# Altium schematic sheet Sheet1_ASC.SchDoc
size A4; SheetNumber: 1; SheetTotal: 1
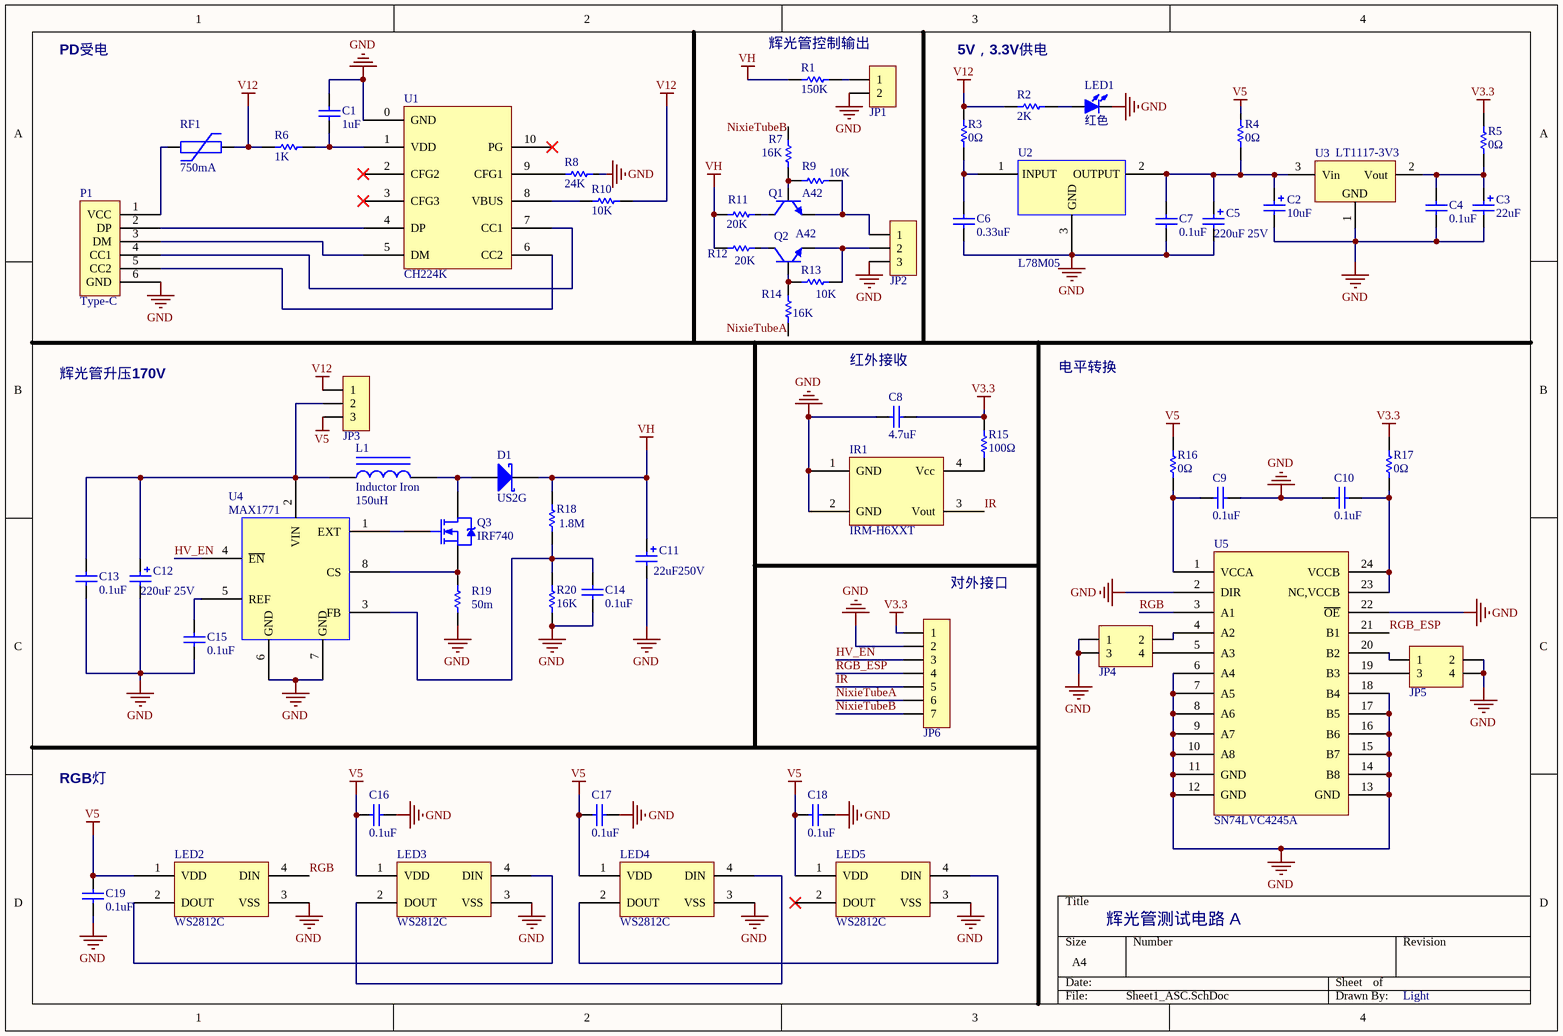
[diagram p0: Sheet1_ASC.SchDoc]

## Parts
C1  value 1uF  [C 0805_L]  (hidden comment: Cap)
C2  value 10uF  [CM B(4*5.4)]  (hidden comment: Cap Pol1)
C3  value 22uF  [CD C(6032)]  (hidden comment: Cap Pol1)
C4  value 0.1uF  [C 0805_L]  (hidden comment: Cap)
C5  value 220uF 25V  [CM E(8*10.2)]  (hidden comment: Cap Pol1)
C6  value 0.33uF  [C 0805_L]  (hidden comment: Cap)
C7  value 0.1uF  [C 0805_L]  (hidden comment: Cap)
C8  value 4.7uF  [C 0805_L]  (hidden comment: Cap)
C9  value 0.1uF  [C 0805_L]  (hidden comment: Cap)
C10  value 0.1uF  [C 0805_L]  (hidden comment: Cap)
C11  value 22uF250V  [CAP 5.0*10*16-H - GD]  (hidden comment: Cap Pol1)
C12  value 220uF 25V  [CM E(8*10.2)]  (hidden comment: Cap Pol1)
C13  value 0.1uF  [C 0805_L]  (hidden comment: Cap)
C14  value 0.1uF  [C 0805_L]  (hidden comment: Cap)
C15  value 0.1uF  [C 0805_L]  (hidden comment: Cap)
C16  value 0.1uF  [C 0805_L]  (hidden comment: Cap)
C17  value 0.1uF  [C 0805_L]  (hidden comment: Cap)
C18  value 0.1uF  [C 0805_L]  (hidden comment: Cap)
C19  value 0.1uF  [C 0805_L]  (hidden comment: Cap)
D1  US2G  [SMA]
IR1  IRM-H6XXT  [SMD4_IR]
JP1  HDR-1X2  [HDR2.54-LI-2P]  (value not drawn)
JP2  HDR-1X3  [HDR2.54-LI-3P]  (value not drawn)
JP3  HDR-1X3  [HDR2.54-LI-3P]  (value not drawn)
JP4  Header2X2  [HDR2.54-LI-2x2P]  (value not drawn)
JP5  Header2X2  [HDR2.54-LI-2x2P]  (value not drawn)
JP6  HDR-1X7  [HDR2.54-LI-7P]  (value not drawn)
L1  Inductor Iron  value 150uH  [CDRH127]
LED1  红色  [LED 1206R]
LED2  WS2812C  [WS2812]
LED3  WS2812C  [WS2812]
LED4  WS2812C  [WS2812]
LED5  WS2812C  [WS2812]
P1  Type-C  [USB-C-SMD_10P-P1.00-L6.8-W8.9]
Q1  A42  [SOT23-3L]
Q2  A42  [SOT23-3L]
Q3  IRF740  [TO-263-2L]
R1  value 150K  [R 0805_L]  (hidden comment: Res Semi)
R2  value 2K  [R 0805_L]  (hidden comment: Resistor)
R3  value 0Ω  [R 0805_L]  (hidden comment: Resistor)
R4  value 0Ω  [R 0805_L]  (hidden comment: Resistor)
R5  value 0Ω  [R 0805_L]  (hidden comment: Resistor)
R6  value 1K  [R 1206_L]  (hidden comment: Resistor)
R7  value 16K  [R 0805_L]  (hidden comment: Resistor)
R8  value 24K  [R 0805_L]  (hidden comment: Resistor)
R9  value 10K  [R 0805_L]  (hidden comment: Resistor)
R10  value 10K  [R 0805_L]  (hidden comment: Resistor)
R11  value 20K  [R 0805_L]  (hidden comment: Res Semi)
R12  value 20K  [R 0805_L]  (hidden comment: Res Semi)
R13  value 10K  [R 0805_L]  (hidden comment: Resistor)
R14  value 16K  [R 0805_L]  (hidden comment: Resistor)
R15  value 100Ω  [R 0805_L]  (hidden comment: Resistor)
R16  value 0Ω  [R 0805_L]  (hidden comment: Resistor)
R17  value 0Ω  [R 0805_L]  (hidden comment: Resistor)
R18  value 1.8M  [R 0805_L]  (hidden comment: Res Semi)
R19  value 50m  [R 1206_L]  (hidden comment: Res Semi)
R20  value 16K  [R 0805_L]  (hidden comment: Resistor)
RF1  750mA  [FU 1812]
U1  CH224K  [ESSOP10]
U2  L78M05  [TO-252-2L]
U3  LT1117-3V3  [SOT223_L]
U4  MAX1771  [SOIC8]
U5  SN74LVC4245A  [TSSOP24_L]

## Nets
GND: C1.2 C2.2 C3.2 C4.1 C5.2 C6.1 C7.1 C8.2 C9.1 C10.2 C11.2 C12.2 C13.1 C14.1 C15.2 C16.1 C17.1 C18.1 C19.1 IR1.1(GND) IR1.2(GND) JP1.2 JP2.3 JP4.1 JP4.3 JP5.2 JP5.4 JP6.2 LED1.2(K) LED2.3(VSS) LED3.3(VSS) LED4.3(VSS) LED5.3(VSS) P1.6(GND) R8.1 R19.2 R20.1 U1.0(GND) U2.3(GND) U3.1(GND) U4.6(GND) U4.7(GND) U5.2(DIR) U5.6(A4) U5.7(A5) U5.8(A6) U5.9(A7) U5.10(A8) U5.11(GND) U5.12(GND) U5.13(GND) U5.14(B8) U5.15(B7) U5.16(B6) U5.17(B5) U5.18(B4) U5.22(~{OE})
V3.3: C8.1 JP6.1 R5.2 R15.2 R17.2
V5: C16.2 C17.2 C18.2 C19.2 JP3.3 LED2.1(VDD) LED3.1(VDD) LED4.1(VDD) LED5.1(VDD) R4.2 R16.2
V12: JP3.1 R2.2 R3.2 R6.2 R10.1 RF1.2
VH: C11.1 D1.2(K) R1.1 R11.1 R12.1 R18.1
HV_EN: JP6.3 U4.4(~{EN})
IR: IR1.3(Vout) JP6.5
NixieTubeA: JP6.6 R14.2
NixieTubeB: JP6.7 R7.2
RGB: LED2.4(DIN) U5.3(A1)
RGB_ESP: JP6.4 U5.21(B1)
NetC1_1: C1.1 R6.1 U1.1(VDD)
NetC2_1: C2.1 C5.1 C7.2 R4.1 U2.2(OUTPUT) U3.3(Vin)
NetC3_1: C3.1 C4.2 R5.1 U3.2(Vout)
NetC6_2: C6.2 R3.1 U2.1(INPUT)
NetC9_2: C9.2 R16.1 U5.1(VCCA)
NetC10_1: C10.1 R17.1 U5.23(NC,VCCB) U5.24(VCCB)
NetC12_1: C12.1 C13.2 JP3.2 L1.1 U4.2(VIN)
NetC14_2: C14.2 R18.2 R20.2 U4.3(FB)
NetC15_1: C15.1 U4.5(REF)
NetD1_1: D1.1(A) L1.2 Q3.2(D)
NetIR1_4: IR1.4(Vcc) R15.1
NetJP1_1: JP1.1 R1.2
NetJP2_1: JP2.1 Q1.2(E) R9.2
NetJP2_2: JP2.2 Q2.2(E) R13.2
NetJP4_2: JP4.2 U5.4(A2)
NetJP4_4: JP4.4 U5.5(A3)
NetJP5_1: JP5.1 U5.20(B2)
NetJP5_3: JP5.3 U5.19(B3)
NetLED1_1: LED1.1(A) R2.1
NetLED2_2: LED2.2(DOUT) LED3.4(DIN)
NetLED3_2: LED3.2(DOUT) LED4.4(DIN)
NetLED4_2: LED4.2(DOUT) LED5.4(DIN)
NetP1_1: P1.1(VCC) RF1.1
NetP1_2: P1.2(DP) U1.4(DP)
NetP1_3: P1.3(DM) U1.5(DM)
NetP1_4: P1.4(CC1) U1.7(CC1)
NetP1_5: P1.5(CC2) U1.6(CC2)
NetQ1_1: Q1.1(B) R7.1 R9.1
NetQ1_3: Q1.3(C) R11.2
NetQ2_1: Q2.1(B) R13.1 R14.1
NetQ2_3: Q2.3(C) R12.2
NetQ3_1: Q3.1(G) U4.1(EXT)
NetQ3_3: Q3.3(S) R19.1 U4.8(CS)
NetR8_2: R8.2 U1.9(CFG1)
NetR10_2: R10.2 U1.8(VBUS)

Not connected (* = marked no-connect by the designer): LED5 2(DOUT)*; U1 2(CFG2)* 3(CFG3)* 10(PG)*

## Notes on the sheet
- PD受电
- (near R1) 辉光管控制输出
- 5V，3.3V供电
- 辉光管升压170V
- 红外接收
- 电平转换
- 对外接口
- RGB灯
- 辉光管测试电路 A
- Light

## Library data of the parts
C1 C4 C6-C10 C13-C19 = Cap: Capacitor; Published: 8-Jun-2000; LatestRevisionDate: 17-Jul-2002; LatestRevisionNote: Re-released for DXP Platform.; PackageReference: RAD-0.3; Publisher: Altium Limited; PackageDescription: Radial Cap, Thru-Hole; 2 Leads; 0.3 in Pin Spacing
C2 C3 = Cap Pol1: Polarized Capacitor (Radial); Published: 8-Jun-2000; LatestRevisionDate: 17-Jul-2002; LatestRevisionNote: Re-released for DXP Platform.; PackageReference: RB7.6-15; Publisher: Altium Limited
C5 C12 = Cap Pol1_2: Polarized Capacitor (Radial); Voltage: 16V; Published: 8-Jun-2000; LatestRevisionDate: 17-Jul-2002; LatestRevisionNote: Re-released for DXP Platform.; PackageReference: RB7.6-15; Publisher: Altium Limited; PackageDescription: Polarized Capacitor (Radial); 2 Leads
C11 = Cap Pol1_3: Polarized Capacitor (Radial); Published: 8-Jun-2000; LatestRevisionDate: 17-Jul-2002; LatestRevisionNote: Re-released for DXP Platform.; PackageReference: RB7.6-15; Publisher: Altium Limited; PackageDescription: Polarized Capacitor (Radial); 2 Leads
D1 = D Schottky: Schottky Diode; Published: 8-Jun-2000; LatestRevisionDate: 17-Jul-2002; LatestRevisionNote: Re-released for DXP Platform.; PackageReference: SMB; Publisher: Altium Limited; PackageDescription: DO-214-AA/SMB; 2 C-Bend Leads; Body 5.3 x 3.6 mm, inc. leads (LxW); Code_JEDEC: DO-214-AA
IR1 = IR
JP1 = Header 2: 2P接插件; 版权归属: 封装库来自淘宝 ID：黄晶宝石; BOM名称: 2P接插件; 联系售后: https://shop463601444.taobao.com
JP2 JP3 = Header 3: 3P接插件; 版权归属: 封装库来自淘宝 ID：黄晶宝石; BOM名称: 3P接插件; 学习资源: https://shop463601444.taobao.com
JP4 JP5 = Header 2X2: 2*2P接插件; 版权归属: 封装库来自淘宝 ID：黄晶宝石; BOM名称: 2*2P接插件; 学习资源: https://shop463601444.taobao.com
JP6 = Header 7: 7P接插件; 版权归属: 封装库来自淘宝 ID：黄晶宝石; BOM名称: 7P接插件; 学习资源: https://shop463601444.taobao.com
L1 = Inductor Iron: Magnetic-Core Inductor; Published: 24-Mar-1999; LatestRevisionDate: 17-Jul-2002; LatestRevisionNote: Re-released for DXP Platform.; PackageReference: AXIAL-0.9; Publisher: Altium Limited; PackageDescription: Axial Device, Thru-Hole; 2 Leads; 0.9 in Pin Spacing
LED1 = LED-SMD: 贴片LED; 版权归属: 封装库来自淘宝 ID：黄晶宝石; BOM名称: 贴片LED; 学习资源: https://shop463601444.taobao.com
LED2-LED5 = WS2812: RGB发光管
P1 = Type-C: Type-C 接口
Q1 Q2 = BCP68: NPN三极管; Published: 17-Sep-2003; LatestRevisionDate: 12-Dec-2006; LatestRevisionNote: IPC-7351 Footprint Added.; DatasheetVersion: 8-Apr-1999; PackageVersion: Aug-2001; PackageReference: SOT223; Publisher: Altium Limited; PackageDescription: 4-Pin SOT-223 Package 2.3 mm Pitch, 7 mm Lead Span; ComponentLink1Description: Manufacturer Link; ComponentLink1URL: http://www.semiconductors.philips.com/; ComponentLink2Description: Datasheet; ComponentLink2URL: http://www.semiconductors.philips.com/acrobat/datasheets/BCP68_4.pdf
Q3 = NMOS-2: N-Channel Power MOSFET; Note: Pin 2 is electrically connected to pin 4.; Published: 8-Jun-2000; LatestRevisionDate: 17-Jul-2002; LatestRevisionNote: Re-released for DXP Platform.; DatasheetVersion: PD-9.814; PackageVersion: Feb-1997; PackageReference: TO-220AB; Publisher: Altium Limited; PackageDescription: TO, Thru-Hole, Vertical, Heatsink Mounted; 3 In-Line Leads; Pitch 2.54 mm; ComponentLink1Description: Manufacturer Link; ComponentLink1URL: http://www.irf.com/
R1 R11 R12 R18 R19 = Res Semi: Semiconductor Resistor; Published: 8-Jun-2000; LatestRevisionDate: 17-Jul-2002; LatestRevisionNote: Re-released for DXP Platform.; PackageReference: AXIAL-0.5; Publisher: Altium Limited
RF1 = PPTC: PPTC自恢复保险丝; 版权归属: 封装库来自淘宝卖家 ID：黄晶宝石; BOM名称: PPTC自恢复保险丝; 学习资源: https://shop463601444.taobao.com
U1 = CH224K: PD协议受电芯片
U3 = AMS1117: 三端稳压芯片; BOM名称: 稳压芯片; 版权归属: 源创客; 学习资源: www.ooocke.com
U5 = 74LVC4245: 双向电平转换
R2-R10 R13-R17 R20 = Resistor: Published: 8-Jun-2000; LatestRevisionDate: 17-Jul-2002; LatestRevisionNote: Re-released for DXP Platform.; PackageReference: AXIAL-0.5; Publisher: Altium Limited